# EAGLE design mcu_board (EAGLE 5.11)
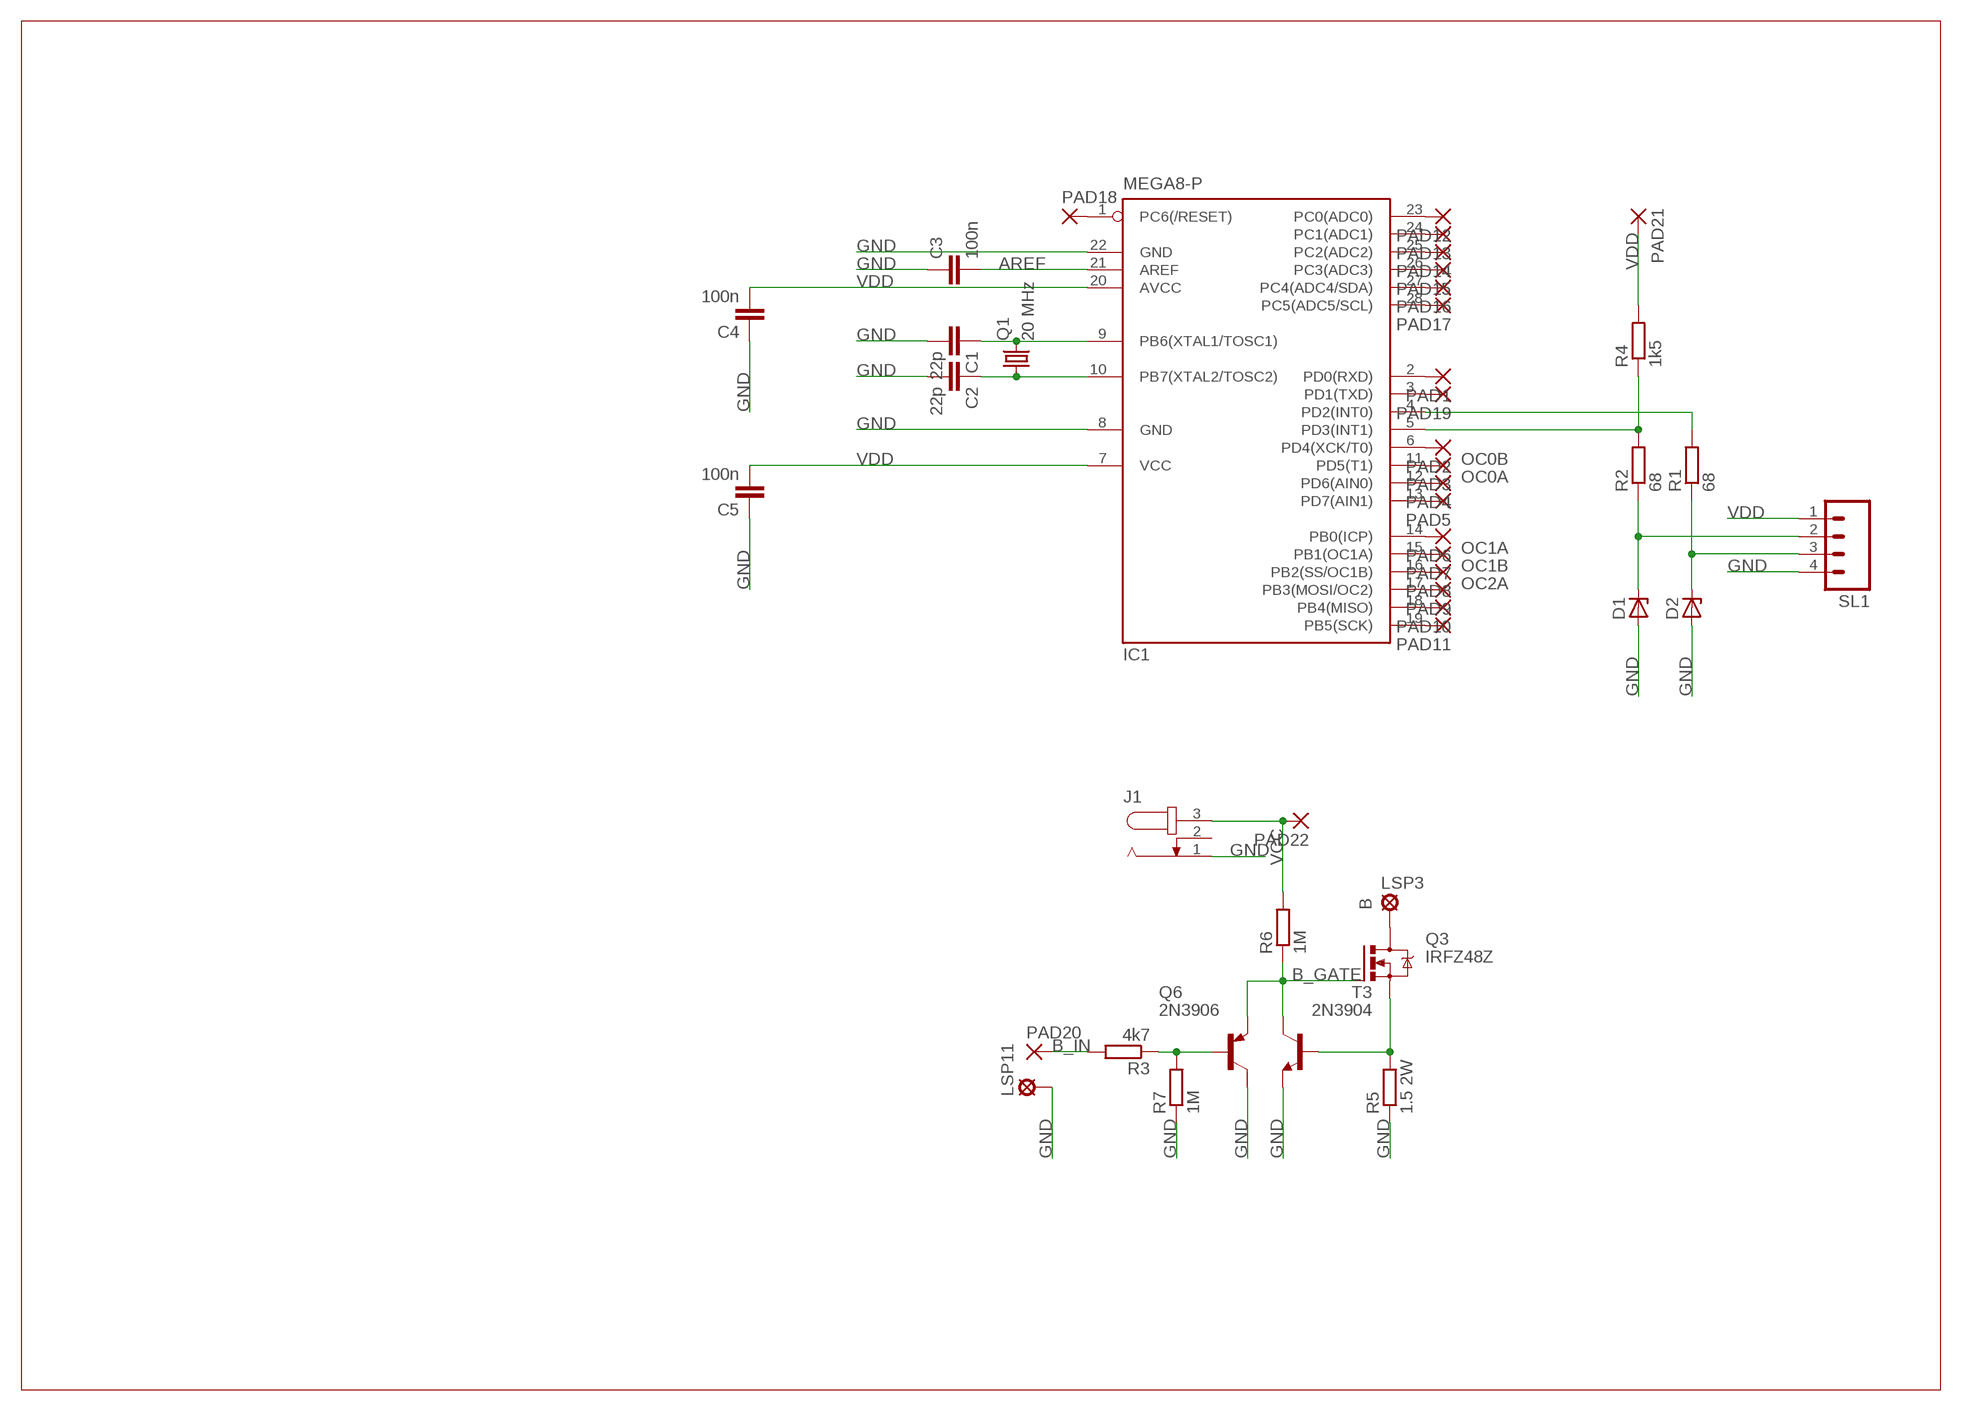
[diagram p0: schematic, sheet 1]

## Parts
C1  22p  C-EUC0805  [C0805]
C2  22p  C-EUC0805  [C0805]
C3  100n  C-EUC1206  [C1206]
C4  100n  C-EUC1206  [C1206]
C5  100n  C-EUC1206  [C1206]
D1  ZENER-DIODESOD80C  [SOD80C]
D2  ZENER-DIODESOD80C  [SOD80C]
IC1  MEGA8-P  [DIL28-3]
J1  JACK-PLUG0  [SPC4077]
LSP3  LSP10  [LSP10]
LSP11  LSP10  [LSP10]
PAD1  1,6/0,8  [1,6/0,8]
PAD2  1,6/0,8  [1,6/0,8]
PAD3  1,6/0,8  [1,6/0,8]
PAD4  1,6/0,8  [1,6/0,8]
PAD5  1,6/0,8  [1,6/0,8]
PAD6  1,6/0,8  [1,6/0,8]
PAD7  1,6/0,8  [1,6/0,8]
PAD8  1,6/0,8  [1,6/0,8]
PAD9  1,6/0,8  [1,6/0,8]
PAD10  1,6/0,8  [1,6/0,8]
PAD11  1,6/0,8  [1,6/0,8]
PAD12  1,6/0,8  [1,6/0,8]
PAD13  1,6/0,8  [1,6/0,8]
PAD14  1,6/0,8  [1,6/0,8]
PAD15  1,6/0,8  [1,6/0,8]
PAD16  1,6/0,8  [1,6/0,8]
PAD17  1,6/0,8  [1,6/0,8]
PAD18  1,6/0,8  [1,6/0,8]
PAD19  1,6/0,8  [1,6/0,8]
PAD20  1,6/0,8  [1,6/0,8]
PAD21  1,6/0,8  [1,6/0,8]
PAD22  1,6/0,8  [1,6/0,8]
Q1  20 MHz  CRYSTALHC49S  [HC49/S]
Q3  IRFZ48Z  [TO220BH]
Q6  2N3906  [TO92]
R1  68  R-EU_R0805  [R0805]
R2  68  R-EU_R0805  [R0805]
R3  4k7  R-EU_R0805  [R0805]
R4  1k5  R-EU_R0805  [R0805]
R5  1.5 2W  R-EU_0207/7  [0207/7]
R6  1M  R-EU_0207/7  [0207/7]
R7  1M  R-EU_R0805  [R0805]
SL1  MA04  [04PA]
T3  2N3904  [TO92]

## Nets
AREF: C3.2 IC1.21(AREF)
B: LSP3.MP Q3.D
B_GATE: Q3.G Q6.3(E) R6.1 T3.1(C)
B_IN: PAD20.1(P) R3.2
GND: C1.2 C2.2 C3.1 C4.1 C5.1 D1.A D2.A IC1.8(GND) IC1.22(GND) J1.1 LSP11.MP Q6.1(C) R5.1 R7.1 SL1.4 T3.3(E)
N$1: C1.1 IC1.9(PB6(XTAL1/TOSC1)) Q1.2
N$2: C2.1 IC1.10(PB7(XTAL2/TOSC2)) Q1.1
N$3: IC1.5(PD3(INT1)) R2.2 R4.1
N$4: IC1.4(PD2(INT0)) R1.2
N$5: IC1.6(PD4(XCK/T0)) PAD2.1(P)
N$6: Q3.S R5.2 T3.2(B)
N$7: D2.C R1.1 SL1.3
N$8: D1.C R2.1 SL1.2
N$9: IC1.2(PD0(RXD)) PAD1.1(P)
N$10: IC1.11(PD5(T1)) PAD3.1(P)
N$11: Q6.2(B) R3.1 R7.2
N$12: IC1.12(PD6(AIN0)) PAD4.1(P)
N$13: IC1.13(PD7(AIN1)) PAD5.1(P)
N$14: IC1.14(PB0(ICP)) PAD6.1(P)
N$15: IC1.15(PB1(OC1A)) PAD7.1(P)
N$16: IC1.16(PB2(SS/OC1B)) PAD8.1(P)
N$17: IC1.17(PB3(MOSI/OC2)) PAD9.1(P)
N$18: IC1.18(PB4(MISO)) PAD10.1(P)
N$19: IC1.19(PB5(SCK)) PAD11.1(P)
N$20: IC1.23(PC0(ADC0)) PAD12.1(P)
N$21: IC1.24(PC1(ADC1)) PAD13.1(P)
N$22: IC1.25(PC2(ADC2)) PAD14.1(P)
N$23: IC1.26(PC3(ADC3)) PAD15.1(P)
N$24: IC1.27(PC4(ADC4/SDA)) PAD16.1(P)
N$25: IC1.28(PC5(ADC5/SCL)) PAD17.1(P)
N$26: IC1.1(PC6(/RESET)) PAD18.1(P)
N$27: IC1.3(PD1(TXD)) PAD19.1(P)
VCC: J1.3 PAD22.1(P) R6.2
VDD: C4.2 C5.2 IC1.7(VCC) IC1.20(AVCC) PAD21.1(P) R4.2 SL1.1
Unconnected: J1.2

## Notes on the sheet
- OC0B
- OC0A
- OC1A
- OC1B
- OC2A

## Library data of the parts
C1-C5 = rcl:C-EU: CAPACITOR, European symbol
D1 D2 = diode:ZENER-DIODE: Z-Diode
IC1 = atmel:MEGA8-P: MICROCONTROLLER 8 Kbytes FLASH, 1 kbytes SRAM, 512 bytes EEPROM, USART, 4-channel 10 bit ADC, 2-channel 8 bit ADC Pin compatible with Atmega48, ATMega88, ATMega168 Source: avr.lbr; OC_FARNELL: unknown; OC_NEWARK: unknown
J1 = con-jack:JACK-PLUG: DC POWER JACK Power Jack, DC, Right Angle, Through Hole, Rated 5A at 16VDC, PC Terminals Distributor: Farnell (www.Farnell.de) Drawing: 84N1161.pdf / 84N1162.pdf Manufacturer: SPC Technology (www.spctechnology.com) Type: SPC4077 / SPC 4078; OC_FARNELL: unknown; OC_NEWARK: unknown
LSP3 LSP11 = solpad:LSP10: SOLDER PAD drill 1.0 mm, distributor Buerklin, 12H555
PAD1-PAD22 = wirepad:1,6/0,8: THROUGH-HOLE PAD
Q1 = crystal:CRYSTAL: CRYSTAL; OC_FARNELL: 1667008; OC_NEWARK: unknown
Q3 = transistor-power:IRFZ48: N Channel HEXFET® Power MOSFET Logic Level Source: http://www.irf.com/product-info/datasheets/data/irfz48z.pdf
Q6 = transistor-pnp:2N3906: PNP Transistor
R1-R4 R7 = rcl:R-EU_: RESISTOR, European symbol
R5 R6 = resistor:R-EU_: RESISTOR, European symbol
SL1 = con-amp-quick:MA04: AMP QUICK CONNECTOR; OC_FARNELL: unknown; OC_NEWARK: unknown
T3 = transistor:2N3904: NPN TRANSISTOR

## Board
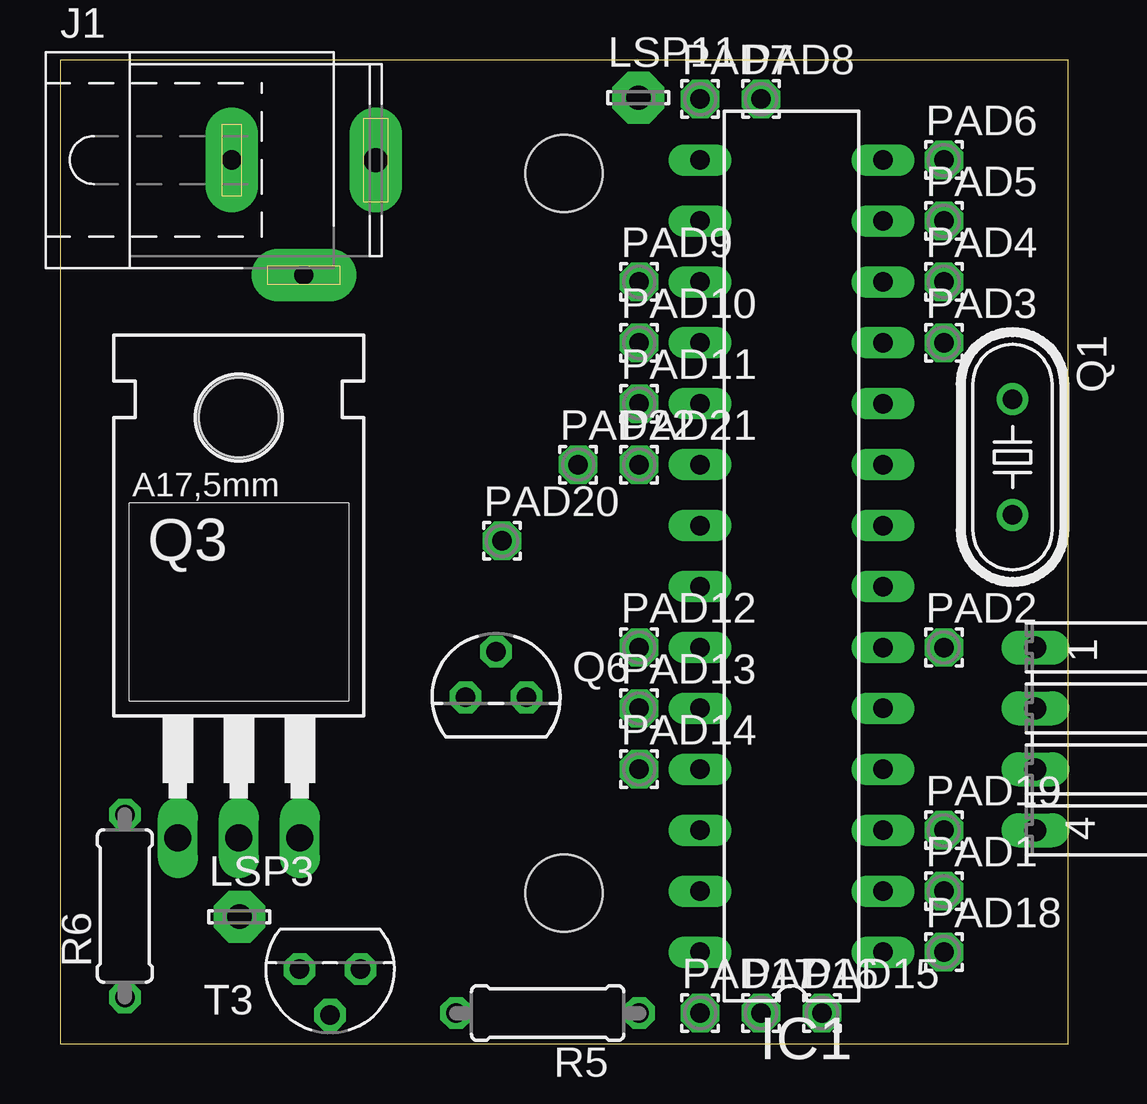
[diagram p1: board, top side]
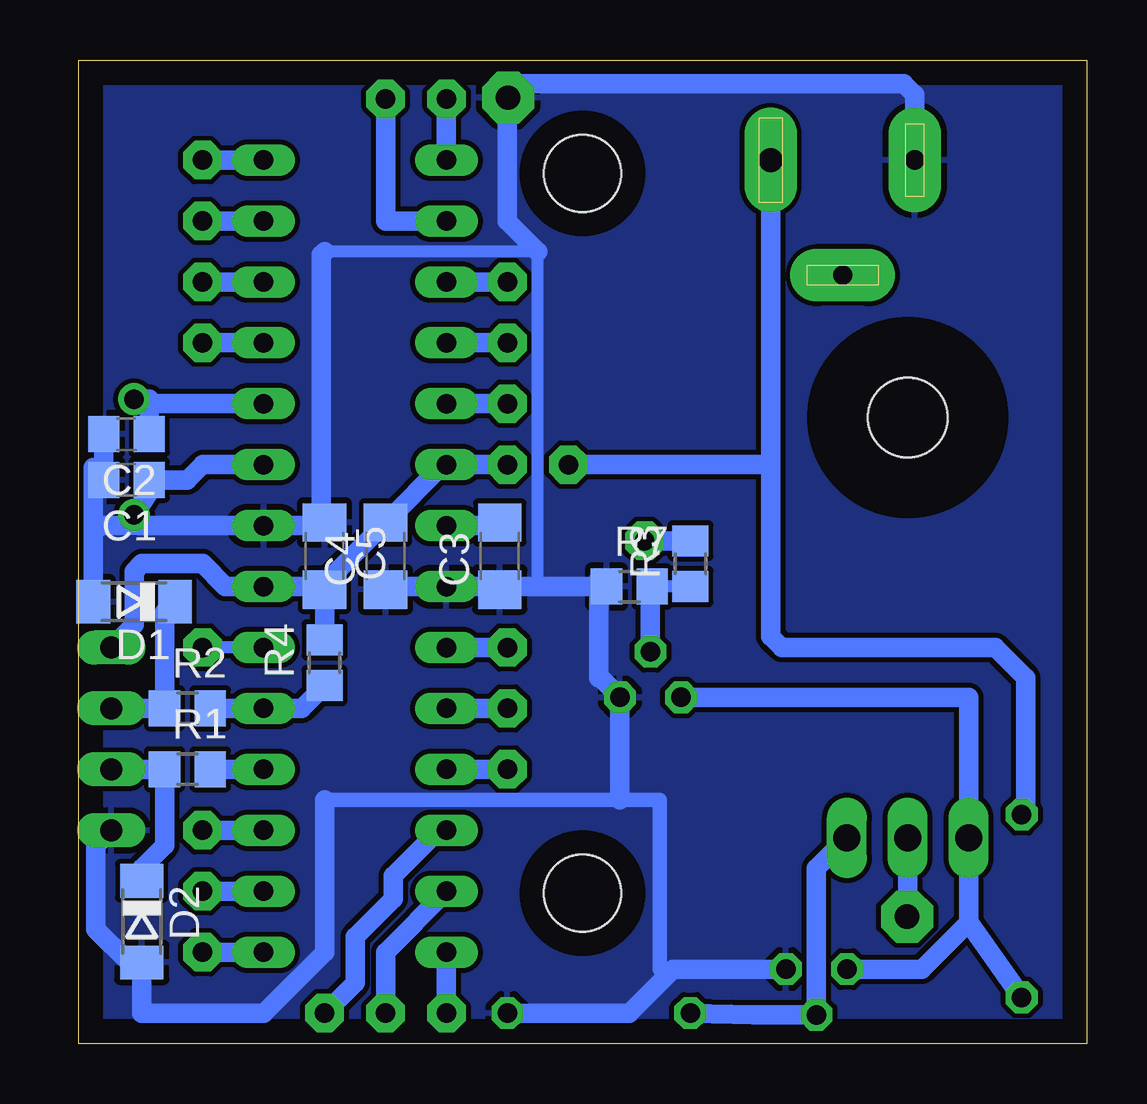
[diagram p2: board, bottom side, seen from below]

Size 42 x 41 mm. Coordinates in mm from the lower left corner, seen from the top.
Outline: 0,0 42,0 42,41 0,41 0,0
Copper layers (1*16): Top 0.035mm / dielectric 1.5mm / Bottom 0.035mm
Design rules "default": minimum track width 10mil, minimum drill 24mil, track to track 8mil, track to pad 8mil, pad to pad 8mil, via to via 8mil, smd to smd 8mil, copper to edge 40mil, drill to drill 8mil, minimum pad ring 10mil, minimum via ring 8mil, stop-mask expansion 4mil, vias tented up to drill 0mil, thermal gap 10mil
Holes 3.2 mm at 21,6.27 21,36.27

### Footprints (pad centres in the part's own frame; a part is rotated, then mirrored left to right if it is on the bottom)
C0805 = smd 1.3 x 1.5: 1 -0.95,0; 2 0.95,0
C1206 = smd 1.6 x 1.8: 1 -1.4,0; 2 1.4,0
SOD80C = smd 1.4 x 1.8: A 1.7,0; C -1.7,0
DIL28-3 = drill 0.813 long: 1 -16.51,-3.81; 2 -13.97,-3.81; 3 -11.43,-3.81; 4 -8.89,-3.81; 5 -6.35,-3.81; 6 -3.81,-3.81; 7 -1.27,-3.81; 8 1.27,-3.81; 9 3.81,-3.81; 10 6.35,-3.81; 11 8.89,-3.81; 12 11.43,-3.81; 13 13.97,-3.81; 14 16.51,-3.81; 15 16.51,3.81; 16 13.97,3.81; 17 11.43,3.81; 18 8.89,3.81; 19 6.35,3.81; 20 3.81,3.81; 21 1.27,3.81; 22 -1.27,3.81; 23 -3.81,3.81; 24 -6.35,3.81; 25 -8.89,3.81; 26 -11.43,3.81; 27 -13.97,3.81; 28 -16.51,3.81
SPC4077 = drill 0.8 pad 2.184 long: 1 -3,0; 2 0,-4.8 | drill 1 pad 2.184 long: 3 3,0
LSP10 = drill 1.016 pad 2.159 octagon: MP 0,0
1,6/0,8 = drill 0.813 pad 1.6 octagon: 1 0,0
HC49/S = drill 0.813 round: 1 -2.413,0; 2 2.413,0
TO220BH = drill 1.118 long: D 0,-6.35; G -2.54,-6.35; S 2.54,-6.35 | hole 3.302: 0,11.176
TO92 = drill 0.813 octagon: 1 1.27,0; 2 0,1.905; 3 -1.27,0
R0805 = smd 1.3 x 1.5: 1 -0.95,0; 2 0.95,0
0207/7 = drill 0.813 octagon: 1 -3.81,0; 2 3.81,0
04PA = drill 0.914 long: 1 -3.81,0; 2 -1.27,0; 3 1.27,0; 4 3.81,0

### Placement (x,y rotation side)
C1  40.01,23.5 180 bottom
C2  40.01,25.4 180 bottom
C3  24.45,20.32 90 bottom
C4  29.21,20.32 90 bottom
C5  31.75,20.32 270 bottom
D1  39.69,18.41 180 bottom
D2  39.37,5.08 270 bottom
IC1  30.48,20.32 90 top
J1  10.16,36.83 0 top
LSP3  7.48,5.29 0 top
LSP11  24.1,39.43 0 top
PAD1  36.83,6.35 0 top
PAD2  36.83,16.51 0 top
PAD3  36.83,29.21 0 top
PAD4  36.83,31.75 0 top
PAD5  36.83,34.29 0 top
PAD6  36.83,36.83 0 top
PAD7  26.67,39.37 0 top
PAD8  29.21,39.37 0 top
PAD9  24.13,31.75 0 top
PAD10  24.13,29.21 0 top
PAD11  24.13,26.67 0 top
PAD12  24.13,16.51 0 top
PAD13  24.13,13.97 0 top
PAD14  24.13,11.43 0 top
PAD15  31.75,1.27 0 top
PAD16  29.21,1.27 0 top
PAD17  26.67,1.27 0 top
PAD18  36.83,3.81 0 top
PAD19  36.83,8.89 0 top
PAD20  18.41,20.95 0 top
PAD21  24.13,24.13 0 top
PAD22  21.59,24.13 0 top
Q1  39.69,24.45 270 top
Q3  7.45,14.92 0 top
Q6  18.17,14.43 0 top
R1  37.47,11.43 0 bottom
R2  37.47,13.97 0 bottom
R3  16.51,20 90 bottom
R4  31.75,15.88 90 bottom
R5  20.32,1.27 180 top
R6  2.7,5.74 90 top
R7  19.05,19.05 0 bottom
SL1  40.64,12.7 270 top
T3  11.26,3.1 180 top

### Tracks (layer width: path | path; a pad name or v marks a point on that pad's centre or on a via)
AREF
  Bottom 0.813: IC1.21 24.26,21.59 C3.2
B
  Bottom 0.813: LSP3.MP 7.45,5.29 Q3.D
B_GATE
  Bottom 0.813: 4.91,5.06 R6.1 2.9,1.73 | 4.91,5.06 Q3.G 4.91,14.43 Q6.3 | T3.1 6.87,3.1 4.91,5.06
B_IN
  Bottom 0.813: PAD20.1 R3.2
GND
  Bottom 0.508: 22.86,19.05 22.86,33.02 31.75,33.02
  Bottom 0.61: 31.75,10.16 19.44,10.16 17.78,10.16 17.78,3.1 17.22,3.1
  Bottom 0.813: 31.88,21.59 IC1.8 41.07,21.59 41.39,21.27 | 31.88,21.59 C5.1 | C4.1 29.08,19.05 IC1.22 24.26,19.05 C3.1 24,19.05 22.86,19.05 R7.1 | C2.2 C1.2 41.39,24.02 41.39,21.27 | 41.39,21.27 D1.A | SL1.4 41.27,8.25 41.27,4.76 39.89,3.38 D2.A 39.37,1.27 34.29,1.27 31.75,3.81 31.75,10.16 | R7.1 20.32,19.37 | R5.1 19.05,1.27 17.22,3.1 T3.3 | 19.44,10.16 Q6.1 20.25,15.24 20.32,15.24 20.32,19.05 R7.1 | J1.1 7.16,39.55 7.62,40.01 23.5,40.01 24.13,39.37 24.13,34.29 22.86,33.02 | 31.88,21.59 31.88,32.89 31.75,33.02
  pour Bottom: 0,0 41.91,0 41.91,40.64 0,40.64
N$1
  Bottom 0.813: Q1.2 39.05,22.99 C1.1 37.47,23.5 36.83,24.13 IC1.9
N$2
  Bottom 0.813: IC1.10 39.05,26.67 C2.1 39.05,26.86 Q1.1
N$3
  Bottom 0.813: R2.2 IC1.5 32.7,13.97 R4.1
N$4
  Bottom 0.813: IC1.4 R1.2
N$5
  Bottom 0.508: IC1.6 PAD2.1
N$6
  Bottom 0.813: Q3.S 11.26,7.3 T3.2 13.9,1.2 R5.2
N$7
  Bottom 0.813: R1.1 SL1.3 | R1.1 | R1.1 38.41,8.26 39.37,7.3 D2.C
N$8
  Bottom 0.813: SL1.2 R2.1 38.41,17.99 D1.C
N$9
  Bottom 0.813: IC1.2 PAD1.1
N$10
  Bottom 0.813: IC1.11 PAD3.1
N$11
  Bottom 0.508: R7.2 R3.1
  Bottom 0.813: Q6.2 18.17,18.98 R7.2
N$12
  Bottom 0.813: IC1.12 PAD4.1
N$13
  Bottom 0.813: IC1.13 PAD5.1
N$14
  Bottom 0.813: IC1.14 PAD6.1
N$15
  Bottom 0.813: IC1.15 PAD7.1
N$16
  Bottom 0.813: IC1.16 29.21,34.29 PAD8.1
N$17
  Bottom 0.813: PAD9.1 IC1.17
N$18
  Bottom 0.813: PAD10.1 IC1.18
N$19
  Bottom 0.813: PAD11.1 IC1.19
N$20
  Bottom 0.813: PAD12.1 IC1.23
N$21
  Bottom 0.813: PAD13.1 IC1.24
N$22
  Bottom 0.813: PAD14.1 IC1.25
N$23
  Bottom 0.813: PAD15.1 30.48,2.54 30.48,4.45 28.89,6.03 28.89,6.99 26.99,8.89 IC1.26
N$24
  Bottom 0.813: PAD16.1 29.21,3.81 IC1.27
N$25
  Bottom 0.813: PAD17.1 IC1.28
N$26
  Bottom 0.813: IC1.1 PAD18.1
N$27
  Bottom 0.813: IC1.3 PAD19.1
VCC
  Bottom 0.813: 13.16,24.13 13.16,16.97 12.7,16.51 3.81,16.51 2.54,15.24 2.54,9.71 R6.2 | 13.16,24.13 J1.3 | 13.16,24.13 PAD22.1
VDD
  Bottom 0.813: C5.2 31.75,19.18 C4.2 26.8,24.13 IC1.20 PAD21.1 | C5.2 31.88,19.05 IC1.7 35.88,19.05 36.83,20 39.37,20 39.69,19.68 39.69,17.46 SL1.1 | C5.2 R4.2

### Text on the board
tDocu: E | B | C | E | B | C